# Altium schematic sheet ST_LINK_V2-1.SCHDOC: STLINK/V2-1
size A4; DocumentNumber: MB1137; Revision: B-01; SheetNumber: 3; SheetTotal: 6; Project: NUCLEO-XXXXZX
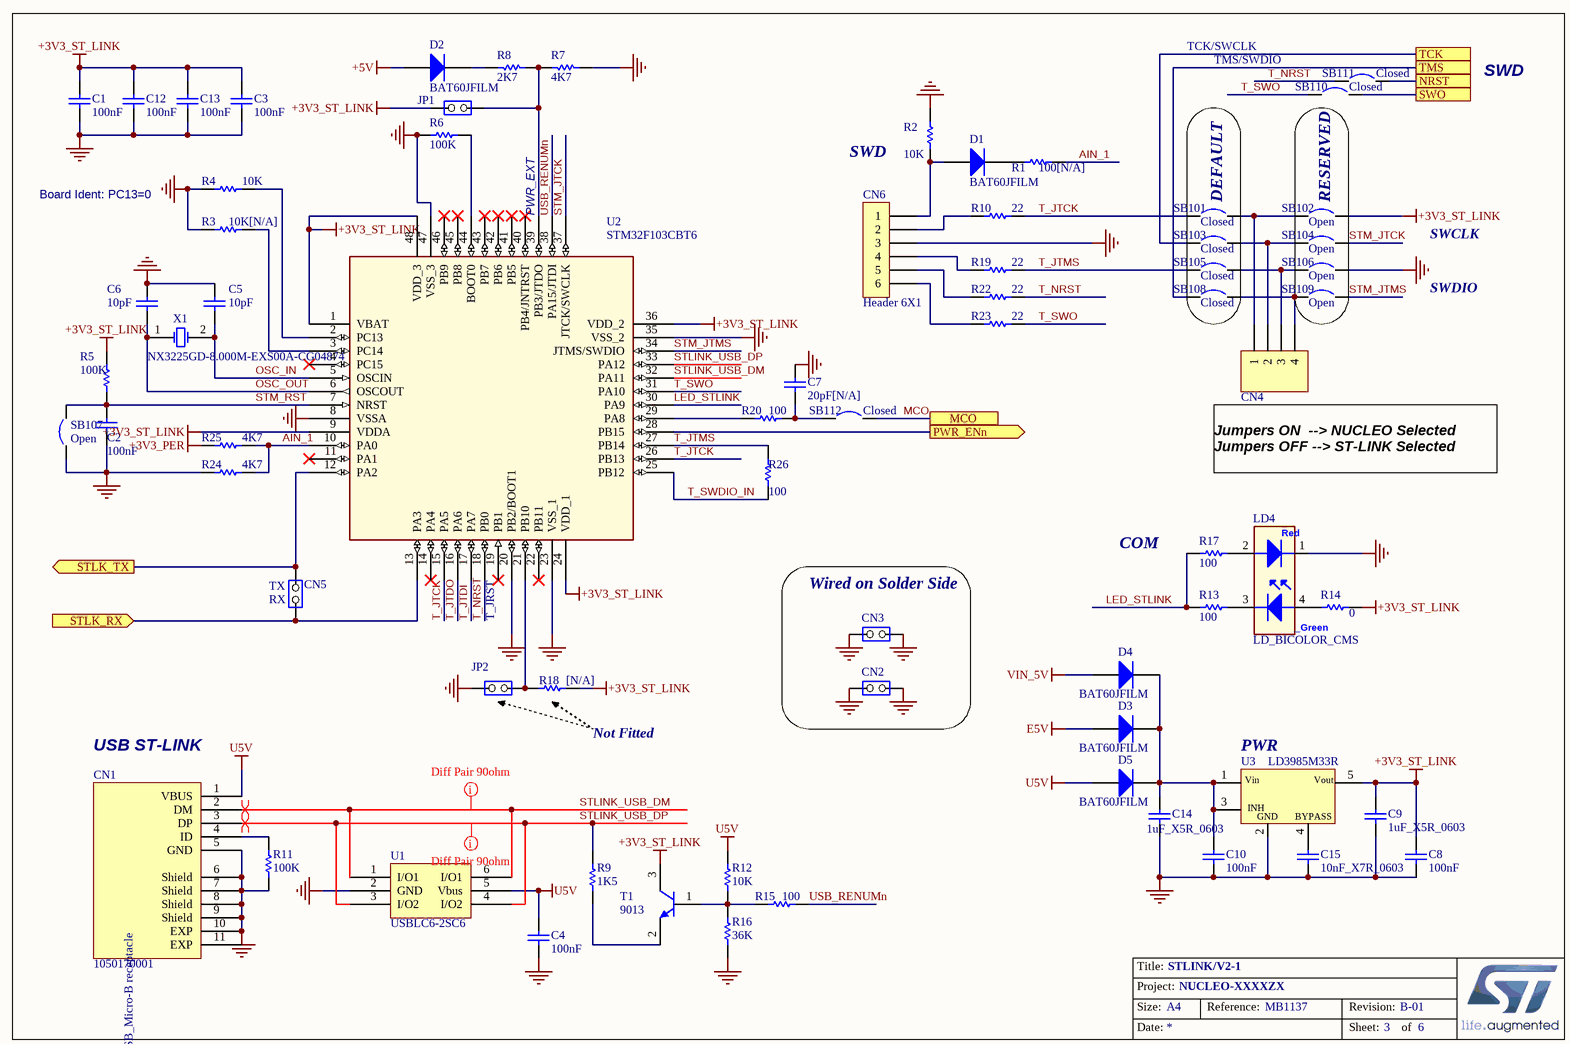
[diagram p0: ST_LINK_V2-1.SCHDOC]

## Parts
C1  100nF  [0603C]
C2  100nF  [0603C]
C3  100nF  [0603C]
C4  100nF  [0603C]
C5  10pF  [0603C]
C6  10pF  [0603C]
C7  20pF[N/A]  [0603C]
C8  100nF  [0603C]
C9  1uF_X5R_0603  [0603C]
C10  100nF  [0603C]
C12  100nF  [0603C]
C13  100nF  [0603C]
C14  1uF_X5R_0603  [0603C]
C15  10nF_X7R_0603  [0603C]
CN1  1050170001  [Molex_1050170001]
CN2  (no value)  [HDR_1x2_2R54_V_M]
CN3  (no value)  [HDR_1x2_2R54_V_M]
CN4  Header 4  [HDR_1x4_2R54_V_M]  (value not drawn)
CN5  (no value)  [HDR_1x2_2R54_V_M_S]
CN6  Header 6X1  [HDR_1x6_2R54_V_M]
D1  BAT60JFILM  [SOD-323]
D2  BAT60JFILM  [SOD-323]
D3  BAT60JFILM  [SOD-323]
D4  BAT60JFILM  [SOD-323]
D5  BAT60JFILM  [SOD-323]
JP1  (no value)  [HDR_1x2_2R54_V_M_S]
JP2  (no value)  [HDR_1x2_2R54_V_M_S]
LD4  LD_BICOLOR_CMS  [HSMF-A201]
R1  100[N/A]  [0603R]
R2  10K  [0603R]
R3  10K[N/A]  [0603R]
R4  10K  [0603R]
R5  100K  [0603R]
R6  100K  [0603R]
R7  4K7  [0603R]
R8  2K7  [0603R]
R9  1K5  [0603R]
R10  22  [0603R]
R11  100K  [0603R]
R12  10K  [0603R]
R13  100  [0603R]
R14  0  [0603R]
R15  100  [0603R]
R16  36K  [0603R]
R17  100  [0603R]
R18  [N/A]  [0603R]
R19  22  [0603R]
R20  100  [0603R]
R22  22  [0603R]
R23  22  [0603R]
R24  4K7  [0603R]
R25  4K7  [0603R]
R26  100  [0603R]
SB101  Closed  [SB_0603]
SB102  Open  [SB_0603]
SB103  Closed  [SB_0603]
SB104  Open  [SB_0603]
SB105  Closed  [SB_0603]
SB106  Open  [SB_0603]
SB107  Open  [SB_0603]
SB108  Closed  [SB_0603]
SB109  Open  [SB_0603]
SB110  Closed  [SB_0603]
SB111  Closed  [SB_0603]
SB112  Closed  [SB_0603]
T1  9013  [SOT-23]
U1  USBLC6-2SC6  [SOT23-6L]
U2  STM32F103CBT6  [LQFP48_0R5_7x7]
U3  LD3985M33R  [SOT-23-5L]
X1  NX3225GD-8.000M-EXS00A-CG04874  [OSC_2SM_3R2x2R5]

## Blocks framed on the sheet
DEFAULT: SB101 SB103 SB105 SB108
RESERVED: SB102 SB104 SB106 SB109
Wired on Solder Side: CN2 CN3

## Ports
MCO, NRST, PWR_ENn (out), STLK_RX (in), STLK_TX (out), SWO, TCK, TMS

## Nets
+3V3_PER: R25.1
+3V3_ST_LINK: C1.2 C3.2 C8.2 C9.1 C12.2 C13.2 JP1.1(COMMON) R5.2 R14.2 R18.1 SB102.2 T1.3(C) U2.1(VBAT) U2.9(VDDA) U2.24(VDD_1) U2.36(VDD_2) U2.48(VDD_3) U3.5(Vout)
+5V: D2.1(A)
E5V: D3.1(A)
GND: C1.1 C2.1 C3.1 C4.1 C5.2 C6.2 C7.2 C8.1 C9.2 C10.1 C12.1 C13.1 C14.1 C15.1 CN1.5(GND) CN1.6(Shield) CN1.7(Shield) CN1.8(Shield) CN1.9(Shield) CN1.10(EXP) CN2.1(COMMON) CN2.2(NO) CN3.1(COMMON) CN3.2(NO) CN6.3 JP2.1(COMMON) LD4.1 R2.2 R3.1 R4.1 R6.1 R7.2 R11.2 R16.1 R24.1 SB106.2 SB107.1 U1.2(GND) U2.8(VSSA) U2.20(PB2/BOOT1) U2.23(VSS_1) U2.35(VSS_2) U2.47(VSS_3) U3.2(GND)
U5V: C4.2 CN1.1(VBUS) D5.1(A) R12.2 U1.5(Vbus)
VIN_5V: D4.1(A)
AIN_1: R1.2 R24.2 R25.2 U2.10(PA0)
LED_STLINK: R13.1 R17.1 U2.30(PA9)
MCO: SB112.2 ; port MCO
NRST: SB111.2 ; port NRST
OSC_IN: C5.1 U2.5(OSCIN) X1.2(OSC2)
OSC_OUT: C6.1 U2.6(OSCOUT) X1.1(OSC1)
PWR_ENn: U2.28(PB15) ; port PWR_ENn
STLINK_USB_DM: CN1.2(DM) U1.1(I/O1) U1.6(I/O1) U2.32(PA11)
STLINK_USB_DP: CN1.3(DP) R9.1 U1.3(I/O2) U1.4(I/O2) U2.33(PA12)
STLK_RX: CN5.1(COMMON) U2.13(PA3) ; port STLK_RX
STLK_TX: CN5.2(NO) U2.12(PA2) ; port STLK_TX
STM_JTCK: SB104.2 U2.37(JTCK/SWCLK)
STM_JTMS: SB109.2 U2.34(JTMS/SWDIO)
STM_RST: C2.2 R5.1 SB107.2 U2.7(NRST)
SWO: SB110.2 ; port SWO
T_JTCK: R10.2 SB101.1 U2.15(PA5) U2.26(PB13)
T_JTDI: U2.17(PA7)
T_JTDO: U2.16(PA6)
T_JTMS: R19.2 R26.2 SB105.1 U2.27(PB14)
T_NRST: R22.2 SB111.1 U2.18(PB0)
T_SWDIO_IN: R26.1 U2.25(PB12)
T_SWO: R23.2 SB110.1 U2.31(PA10)
TCK: SB103.1 ; port TCK
TMS: SB108.1 ; port TMS
USB_RENUMn: R15.2 U2.38(PA15/JTDI)
NetC7_1: C7.1 R20.2 SB112.1
NetC10_2: C10.2 C14.2 D3.2(K) D4.2(K) D5.2(K) U3.1(Vin) U3.3(CE)
NetC15_2: C15.2 U3.4(BYPASS)
NetCN1_4: CN1.4(ID) R11.1
NetCN4_1: CN4.1 SB101.2 SB102.1
NetCN4_2: CN4.2 SB103.2 SB104.1
NetCN4_3: CN4.3 SB105.2 SB106.1
NetCN4_4: CN4.4 SB108.2 SB109.1
NetCN6_1: CN6.1 D1.1(A) R2.1
NetCN6_2: CN6.2 R10.1
NetCN6_4: CN6.4 R19.1
NetCN6_5: CN6.5 R22.1
NetCN6_6: CN6.6 R23.1
NetD1_2: D1.2(K) R1.1
NetD2_2: D2.2(K) R8.1
NetJP1_2: JP1.2(NO) R7.1 R8.2 U2.39(PB3/JTDO)
NetJP2_2: JP2.2(NO) R18.2 U2.21(PB10)
NetLD4_2: LD4.2 R17.2
NetLD4_3: LD4.3 R13.2
NetLD4_4: LD4.4 R14.1
NetR3_2: R3.2 U2.3(PC14)
NetR4_2: R4.2 U2.2(PC13)
NetR6_2: R6.2 U2.44(BOOT0)
NetR9_2: R9.2 T1.2(E)
NetR12_1: R12.1 R15.1 R16.2 T1.1(B)
NetR20_1: R20.1 U2.29(PA8)

Not connected (* = marked no-connect by the designer): CN1 11(EXP); U2 4(PC15)* 11(PA1)* 14(PA4)* 19(PB1)* 22(PB11)* 40(PB4/JNTRST)* 41(PB5)* 42(PB6)* 43(PB7)* 45(PB8)* 46(PB9)*

## Layout directives
differential pair: (no net found under the mark)
mark named Diff Pair 90ohm: STLINK_USB_DM, STLINK_USB_DP

## Notes on the sheet
- TCK/SWCLK
- TMS/SWDIO
- SWD
- Board Ident: PC13=0
- (near U2) PWR_EXT
- SWCLK
- SWDIO
- Jumpers ON  --> NUCLEO Selected
  Jumpers OFF --> ST-LINK Selected
- (near CN5) TX
- COM
- (near CN5) RX
- T_JRST
- (near CN1) USB ST-LINK
- (near R18) Not Fitted
- (near U3) PWR
- Title:
- Project:
- Size:
- Date:
- A4
- Reference:
- Sheet:
- Revision:
- of
- (in symbol 1050170001) USB_Micro-B receptacle
- (in symbol LD3985M33R) INH
- (in symbol LD_BICOLOR_CMS) Red; _Green

## Library data of the parts
C1-C4 C8 C10 C12 C13 = Capacitor_ST: Capacitor 0402 / 0603 / 0805; Revision: July-2002: Re-released for DXP Platform.; Value: 100nF
C5-C7 = Capacitor_ST: Capacitor 0402 / 0603 / 0805; Value: 100nF; Revision: July-2002: Re-released for DXP Platform.
C9 C14 = CAP SMD 0603  X5R 1礔 25V 10%: 0603  X5R 1礔; Rated voltage: 25V; Tolerance: 10%; Manufacturer: *; Manufacturer P/N: *; Order code Farnell: 1288202RL; Value: 1礔; Power: *; Technology: X5R; Temperature  Factor: *; Temperature Max: +125癈; Temperature Min: -55癈; STS Code: *
C15 = CAP SMD 0603  X7R 10000PF 50V 10%: 0603  X7R 10NF; Order code RS: 2040779; Rated voltage: 50V; Tolerance: 10%; Order code Farnell: 7569548RL; Value: 10NF; Power: *; Technology: X7R; Temperature Factor: *; Temperature Min: -55癈; Temperature Max: +125癈; STS Code: *
CN1 = 1050170001: Silkscreen: USB
CN2 CN3 JP1 JP2 = JP2
CN4 = Header 4: Header, 4-Pin, Single row; Revision: 17-Jul-2002: Re-released for DXP Platform.; Publisher: Altium Limited
CN5 = JP2: Fitted: NO
CN6 = Header 6X1: Header, 6-Pin, Single row; LatestRevisionDate: 17-Jul-2002; LatestRevisionNote: Re-released for DXP Platform.; Publisher: Altium Limited
D1 D3-D5 = BAT60JFILM: Manuf_1: STM; Provided: ST; ECCN_US/EU: EAR99/NEC; Revision: July-2002: Re-released for DXP Platform.; Order: BAT60JFILM; Manuf_Part_1: BAT60JFILM; Distrib: ST
D2 = Diode: Default Diode; Code - JEDEC: DO-214-AB; Ordered by: STM; ECCN_US/EU: EAR99/NEC; Published: 8-Jun-2000; Revision: July-2002: Re-released for DXP Platform.; Publisher: Altium Limited
LD4 = LD_BICOLOR_CMS: Bicolor Led; Manuf_Part_1: HSMF-A201-A00J1; Manuf_1: Avago Technologies; Ref St: xxxxxx; cap_dec: ----; Distrib: RADIOSPARES
R1 R5 R6 R9-R11 R13-R15 R17 R19 R20 R22 R23 R26 = Resistor_ST: Resistor 0402 / 0603 / 0805; Value: 10K
R2 R4 = Resistor_ST: Resistor 0402 / 0603 / 0805; Value: 10K
R3 R24 R25 = Resistor_ST: Resistor 0402 / 0603 / 0805; Value: 10K; Fitted: NO
R7 R8 R12 R16 R18 = Res1: Resistor; Value: 1K; Published: 8-Jun-2000; Revision: July-2002: Re-released for DXP Platform.; Publisher: Altium Limited
SB101 SB103 SB105 SB108 SB110-SB112 = Circuit Breaker_close: Circuit Breaker; Published: 24-Mar-1999; Revision: July-2002: Re-released for DXP Platform.; Publisher: Altium Limited
SB102 SB104 SB106 SB107 SB109 = Circuit Breaker: Published: 24-Mar-1999; Revision: July-2002: Re-released for DXP Platform.; Publisher: Altium Limited
T1 = NPN: NPN Bipolar Transistor; Code - JEDEC: TO-226-AA; Published: 8-Jun-2000; Revision: July-2002: Re-released for DXP Platform.; Publisher: Altium Limited
U2 = STM32F103CBT6: Medium-density performance line ARM-based 32-bit MCU with 64KB Flash; Manuf_Part_1: STM32F103C8T6; Manuf_1: STM; Ref St: 9175981; Provided: ST; ECCN_US/EU: 3A991A2/NEC; Footprint: QFP48 7X7; Distrib: ST; Order: STM32F103C8T6
U3 = LD3985M33R: Ultra low drop-low noise BiCMOS voltage, regulators low ESR capacitors compatible; Manuf_1: STM; Provided: ST; Ref St: 9176161; ECCN_US/EU: EAR99/NEC; Manuf_Part_1: LD3985M33R; Distrib: ST; Order: LD3985M33R
X1 = XTAL: Crystal Oscillator; Published: 8-Jun-2000; LatestRevisionDate: 17-Jul-2002; LatestRevisionNote: Re-released for DXP Platform.; PackageReference: R38; Publisher: Altium Limited